# EAGLE schematic ESP32 Weather (EAGLE 6.4)
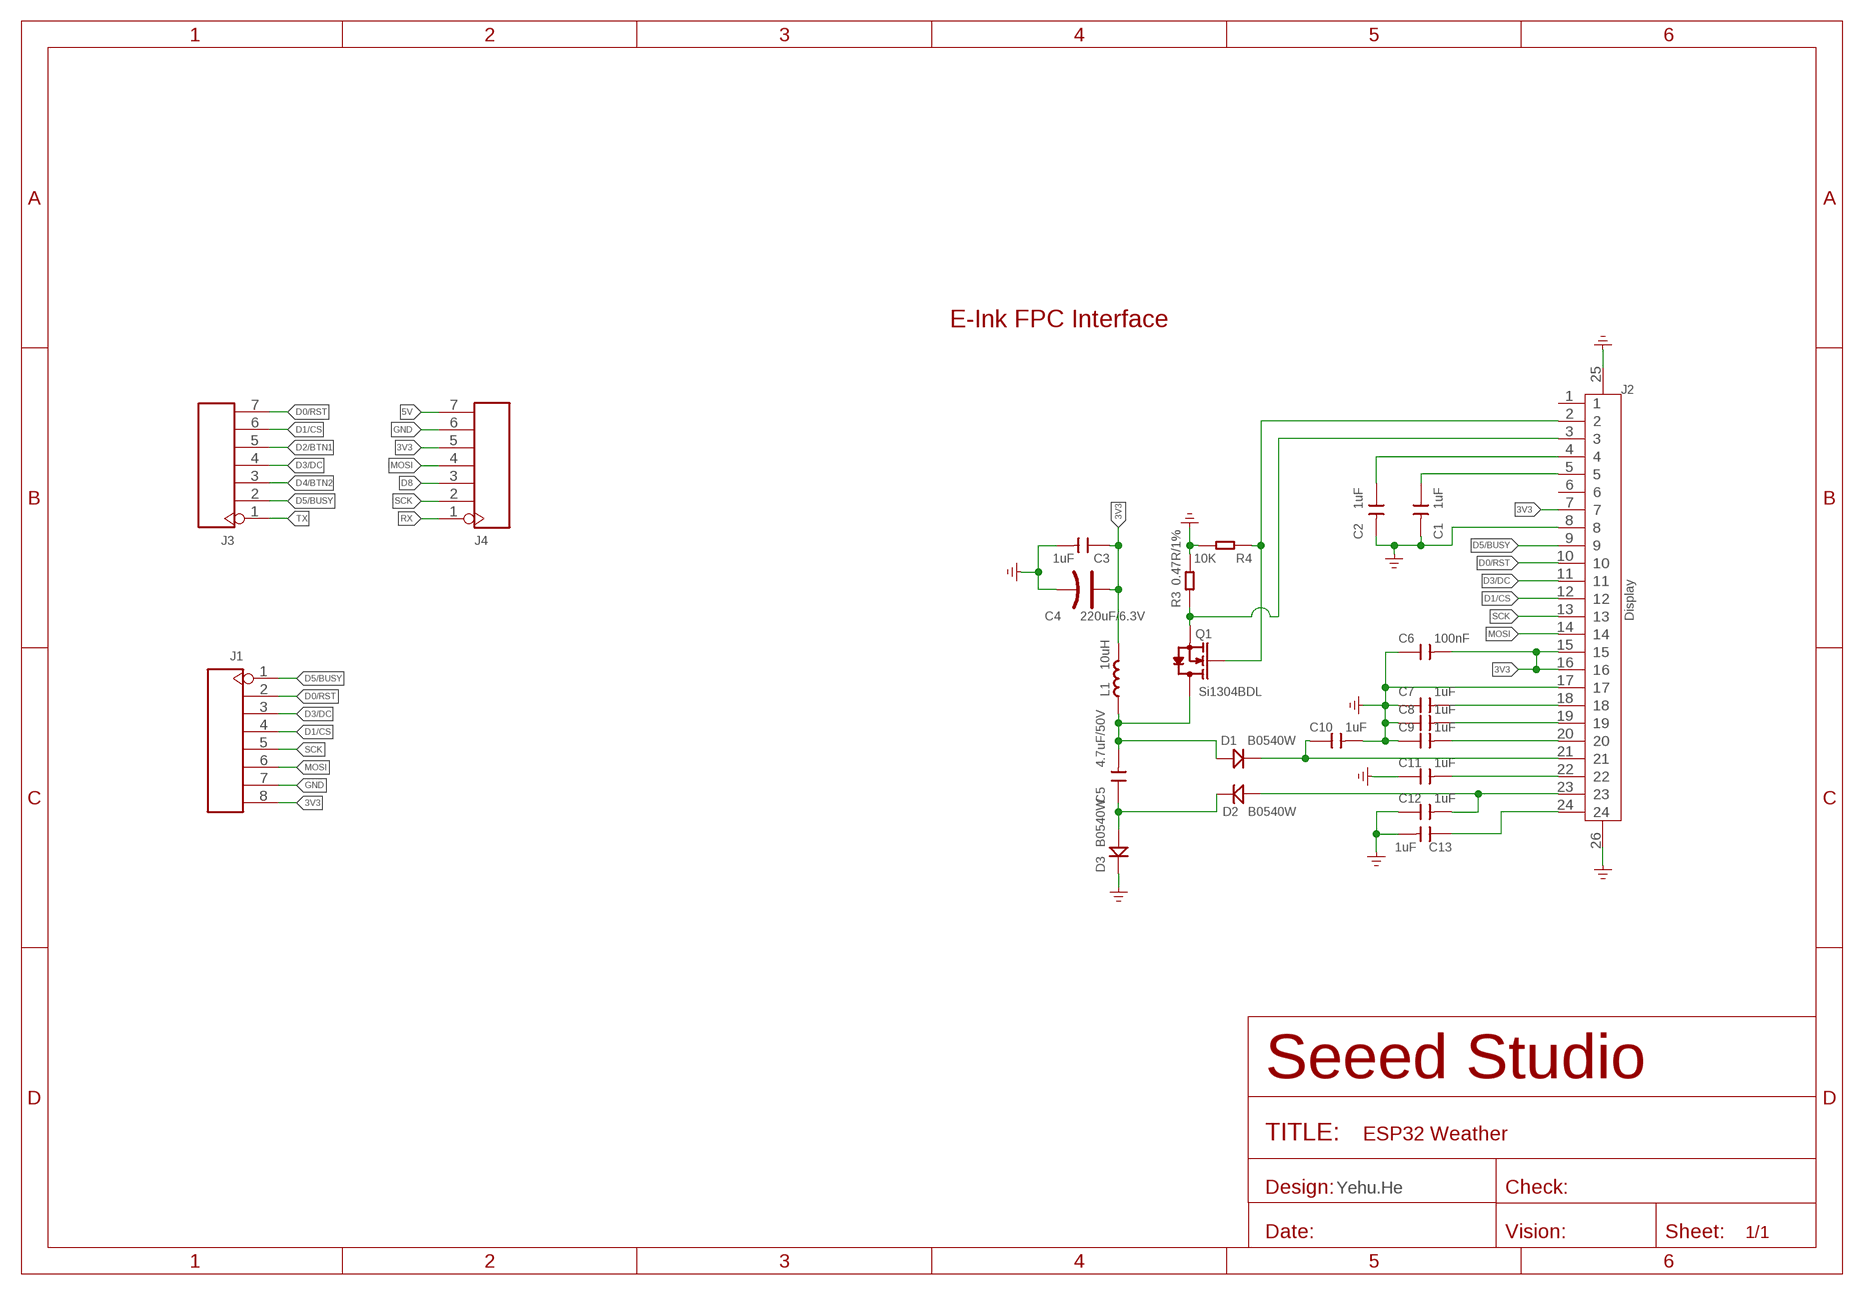
[diagram p0: schematic, sheet 1]

## Parts
C1  1uF  CAP-0603  [C0603]
C2  1uF  CAP-0603  [C0603]
C3  1uF  CAP-0603  [C0603]
C4  220uF/6.3V  CAP-POLAR-AVX-B  [AVX-B]
C5  4.7uF/50V  CAP-1206  [C1206]
C6  100nF  CAP-0603  [C0603]
C7  1uF  CAP-0603  [C0603]
C8  1uF  CAP-0603  [C0603]
C9  1uF  CAP-0603  [C0603]
C10  1uF  CAP-0603  [C0603]
C11  1uF  CAP-0603  [C0603]
C12  1uF  CAP-0603  [C0603]
C13  1uF  CAP-0603  [C0603]
D1  B0540W  DIODE'0805'  [SOD-323]
D2  B0540W  DIODE'0805'  [SOD-323]
D3  B0540W  DIODE'0805'  [SOD-323]
J1  HEADER-8P-80/40MIL  [H8-2.54-C80D40MIL]
J2  Display  FPC-CONNECTOR-24P  [FPCB24-SMD-0.5-17.6X5.0X2MM]
J3  HEADER-7P-18.28X2.5  [H7-2.54-18.28X2.5X5MM]
J4  HEADER-7P-18.28X2.5  [H7-2.54-18.28X2.5X5MM]
L1  10uH  INDUCTOR-SPD3D16-4R7M  [L0420]
Q1  Si1304BDL  MOSFET-N'SI1304BDL'  [SOT-323]
R3  0.47R/1%  RES-0603  [R0603]
R4  10K  RES-0603  [R0603]

## Nets
3V3: C3.1 C4.+ C6.2 J1.8 J2.7 J2.15 J2.16 J4.5 L1.2
5V: J4.7
D0/RST: J1.2 J2.10 J3.7
D1/CS: J1.4 J2.12 J3.6
D2/BTN1: J3.5
D3/DC: J1.3 J2.11 J3.4
D4/BTN2: J3.3
D5/BUSY: J1.1 J2.9 J3.2
D8: J4.3
GDR: J2.2 Q1.1(G) R4.1
GND: C1.2 C2.2 C3.2 C4.- C6.1 C7.1 C8.1 C9.1 C10.2 C11.1 C12.1 C13.2 D3.- J1.7 J2.8 J2.17 J2.25(P1) J2.26(P2) J4.6 R3.2 R4.2 ; supply symbol labelled GND_POWER
MOSI: J1.6 J2.14 J4.4
N$1: C2.1 J2.4
N$9: C5.1 D2.- D3.+
N$11: C5.2 D1.+ L1.1 Q1.3(D)
N$22: C7.2 J2.18
N$23: C8.2 J2.19
N$24: C9.2 J2.20
N$25: C10.1 D1.- J2.21
N$26: C11.2 J2.22
N$27: C12.2 D2.+ J2.23
RESE: J2.3 Q1.2(S) R3.1
RX: J4.1
SCK: J1.5 J2.13 J4.2
TX: J3.1
VCOM: C13.1 J2.24
VGH: C1.1 J2.5
Unconnected: J2.1 J2.6

## Notes on the sheet
- E-Ink FPC Interface
- Yehu.He

## Library data of the parts
C1-C3 C5-C13 = Discrete-new:CAP: Ceramic Capacitors
C4 = Discrete-new:CAP-POLAR: Electrolytic Capacitors,Tantalum Capacitors and Super Capacitors
D1-D3 = Discrete-new:DIODE*
J1 = Connector-new:HEADER-8P
J2 = Connector-new:FPC-CONNECTOR-24P
J3 J4 = 0703:HEADER-7P
L1 = Discrete-new:INDUCTOR
Q1 = Discrete-new:MOSFET-N: IRLL014: http://www.vishay.com/docs/91319/sihll014.pdf
R3 R4 = Discrete-new:RES